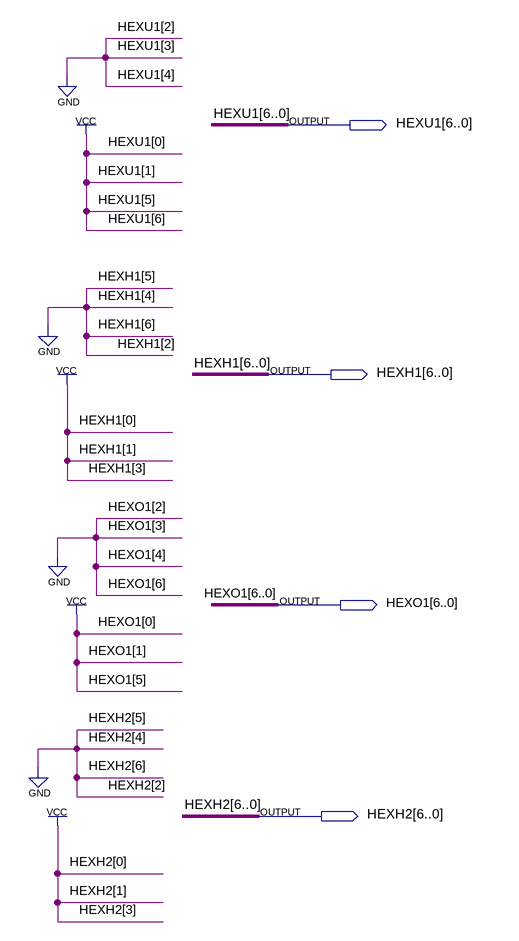
[diagram p0: schematic sheet]
// Quartus schematic UhOh.bdf as structural Verilog: 0 symbols, 4 pins
module UhOh (
  output [6:0] HEXU1,
  output [6:0] HEXH1,
  output [6:0] HEXO1,
  output [6:0] HEXH2
);


  assign HEXH1 = 7'b0001011;
  assign HEXH2 = 7'b0001011;
  assign HEXO1 = 7'b0100011;
  assign HEXU1 = 7'b1100011;
endmodule
